# Altium project Blue_bug.PrjPcb
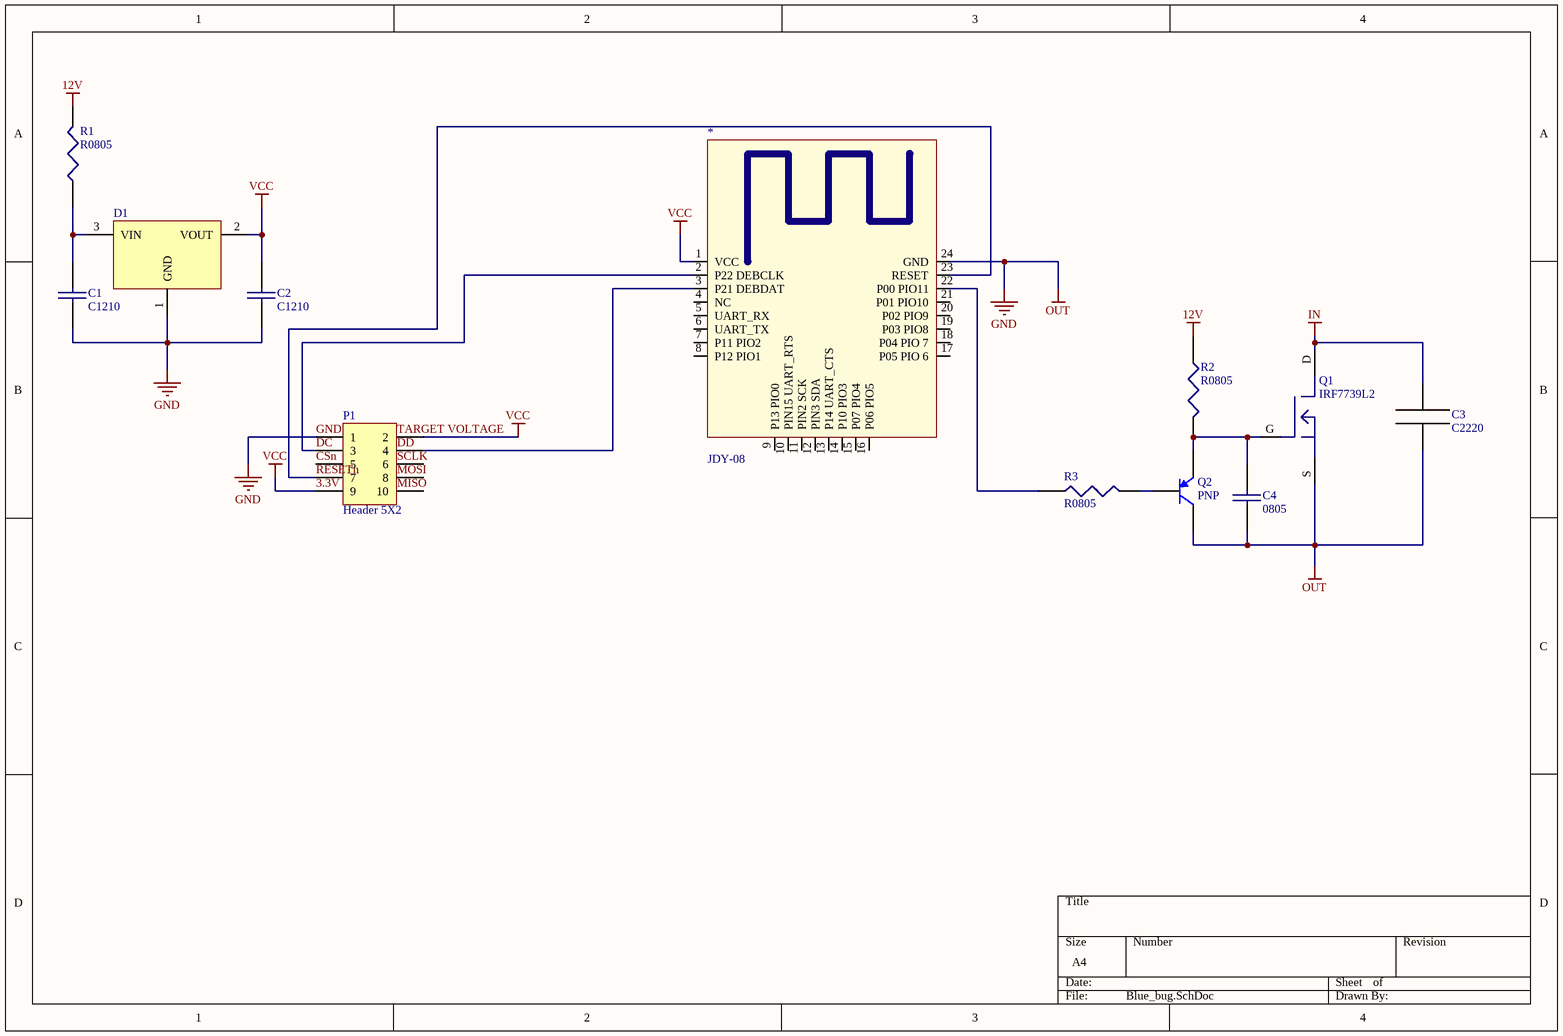
[diagram p0: Blue_bug.SchDoc]
1 sheet, 12 parts. Net scope: global (net labels, ports and power ports of the same name join across sheets).
Board file: Blue_bug.PcbDoc

## Sheet Blue_bug.SchDoc
size A4

### Parts
*  JDY-08  [JDY-08]
C1  C1210  [C1210]
C2  C1210  [C1210]
C3  С2220  [C2220]
C4  0805  [C0805]
D1  AMS1117CD_3.3  [SOT223]  (value not drawn)
P1  Header 5X2  [HDR2X5]
Q1  IRF7739L2  [DirFET L8]
Q2  PNP  [SOT-23B_N]
R1  R0805  [R0805]
R2  R0805  [R0805]
R3  R0805  [R0805]

### Nets
3.3V: *.1(VCC) C2.2 D1.2(VOUT) P1.2 P1.9  [also labelled VCC]
12V: R1.1 R2.2
GND: *.24(GND) C1.1 C2.1 C3.1 C4.1 D1.1(GND) P1.1 Q1.S Q2.1(C)  [also labelled OUT]
IN: C3.2 Q1.D
CSn: P1.5
DC: *.2(P22_DEBCLK) P1.3
RESETn: *.23(RESET) P1.7
Net*_3: *.3(P21_DEBDAT) P1.4
Net*_22: *.22(P00_PIO11) R3.2
NetC1_2: C1.2 D1.3(VIN) R1.2
NetC4_2: C4.2 Q1.G Q2.3(E) R2.1
NetQ2_2: Q2.2(B) R3.1

Not connected (* = marked no-connect by the designer): * 4(NC) 5(UART_RX) 6(UART_TX) 7(P11_PIO2) 8(P12_PIO1) 9(P13_PIO0) 10(PIN15_UART_RTS) 11(PIN2_SCK) 12(PIN3_SDA) 13(P14_UART_CTS) 14(P10_PIO3) 15(P07_PIO4) 16(P06_PIO5) 17(P05_PIO_6) 18(P04_PIO_7) 19(P03_PIO8) 20(P02_PIO9) 21(P01_PIO10); P1 6 8 10

### Notes on the sheet
- Labels drawn without touching a wire or pin: DD, MISO, MOSI, SCLK, TARGET VOLTAGE

### Library data of the parts
C4 = 0805: Capasitor
P1 = Header 5X2: Header, 5-Pin, Dual row; LatestRevisionDate: 17-Jul-2002; LatestRevisionNote: Re-released for DXP Platform.; Publisher: Altium Limited
Q2 = PNP: PNP Bipolar Transistor; Published: 8-Jun-2000; LatestRevisionDate: 29-May-2009; LatestRevisionNote: IPC-7351 Footprint Added.; PackageVersion: Aug-1999; PackageReference: SOT-23B; Publisher: Altium Limited; PackageDescription: 3-Pin SOT-23 Package 0.95 mm Pitch, 2.4 mm Lead Span